# EasyEDA Pro project ProPrj_cap banks_2026-02-15.epro, schematic Schematic3_1
Board Name: RM1822F(pancake)_1; Create Date: 2025-12-31; Page Name: P1; Project Name: cap bank training; Schematic Name: Schematic3_1; Update Date: 2025-12-31; Company: EasyEDA.com; Page Size: A4; Version: V1.0
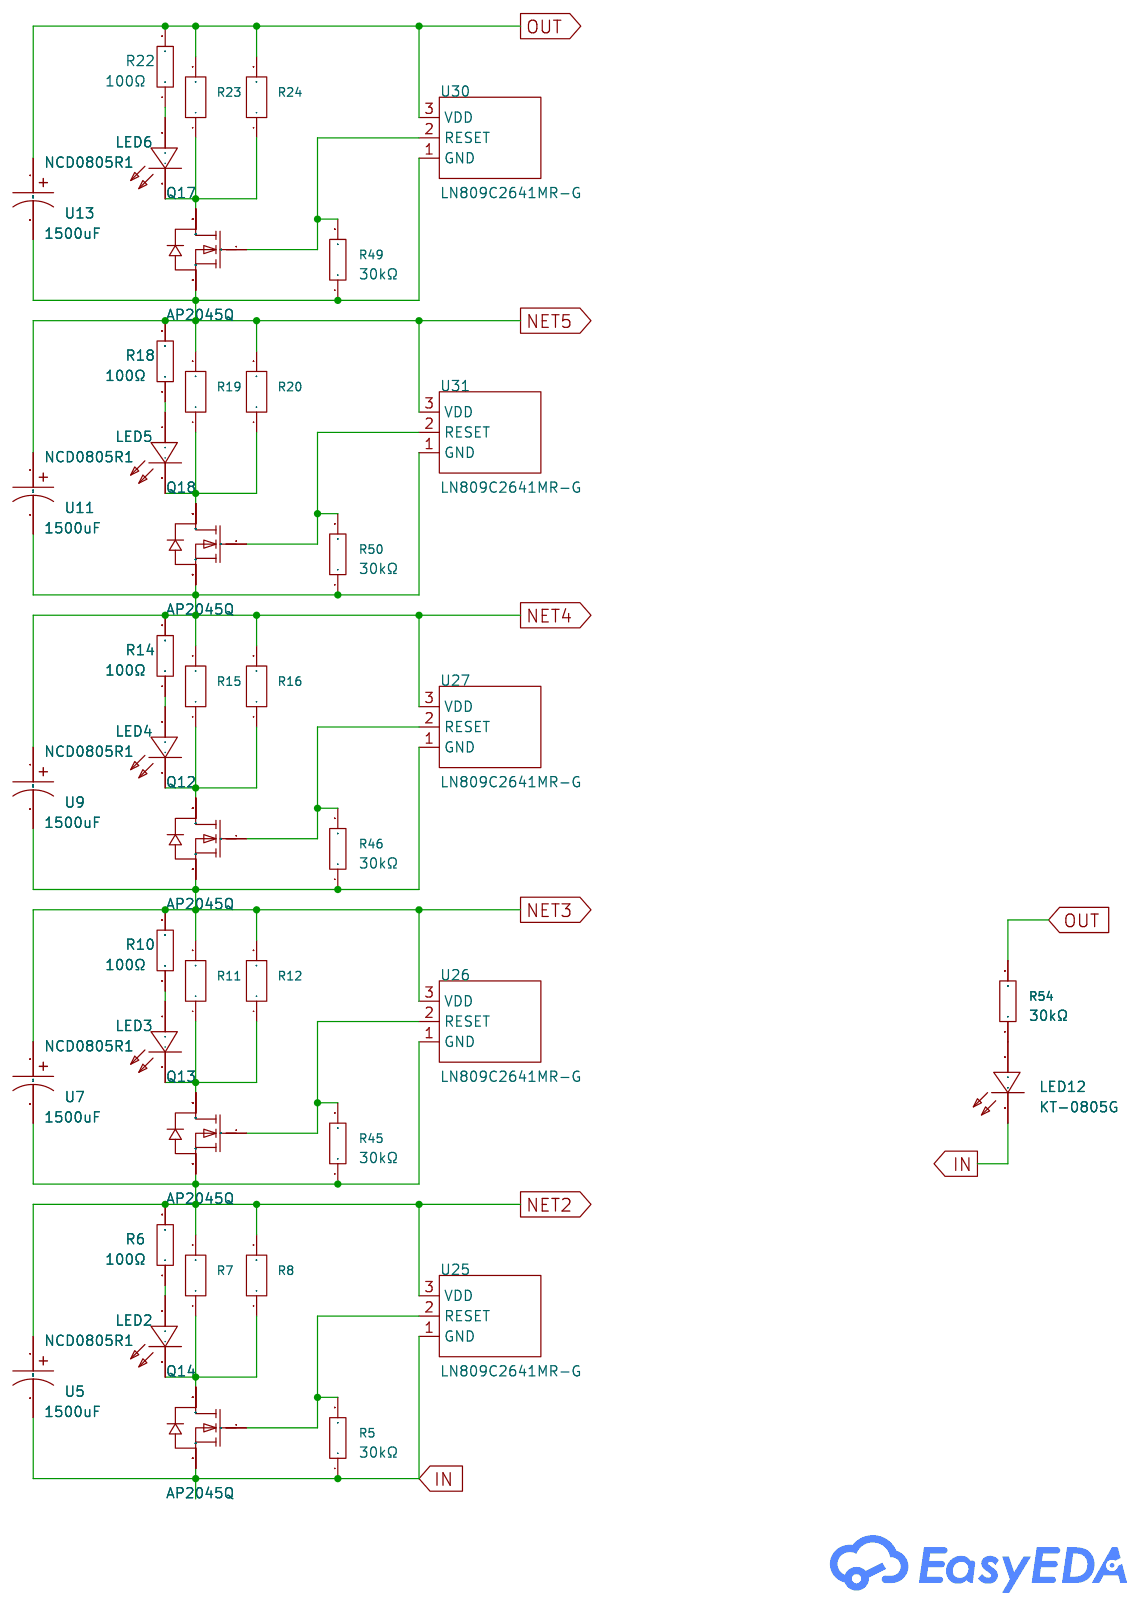
[diagram p3: schematic sheet]

## Parts
LED2  NCD0805R1  [LED0805-R-RD]
LED3  NCD0805R1  [LED0805-R-RD]
LED4  NCD0805R1  [LED0805-R-RD]
LED5  NCD0805R1  [LED0805-R-RD]
LED6  NCD0805R1  [LED0805-R-RD]
LED12  KT-0805G  [LED0805-R-RD]
Q12  AP2045Q  [DFN-8_L3.1-W3.0-P0.65-LS3.3-BL]
Q13  AP2045Q  [DFN-8_L3.1-W3.0-P0.65-LS3.3-BL]
Q14  AP2045Q  [DFN-8_L3.1-W3.0-P0.65-LS3.3-BL]
Q17  AP2045Q  [DFN-8_L3.1-W3.0-P0.65-LS3.3-BL]
Q18  AP2045Q  [DFN-8_L3.1-W3.0-P0.65-LS3.3-BL]
R5  30kΩ  [R0805]
R6  100Ω  [R0805]
R7  1Ω  [R2512]
R8  1Ω  [R2512]
R10  100Ω  [R0805]
R11  1Ω  [R2512]
R12  1Ω  [R2512]
R14  100Ω  [R0805]
R15  1Ω  [R2512]
R16  1Ω  [R2512]
R18  100Ω  [R0805]
R19  1Ω  [R2512]
R20  1Ω  [R2512]
R22  100Ω  [R0805]
R23  1Ω  [R2512]
R24  1Ω  [R2512]
R45  30kΩ  [R0805]
R46  30kΩ  [R0805]
R49  30kΩ  [R0805]
R50  30kΩ  [R0805]
R54  30kΩ  [R0805]
U5  1500uF  [CAP-TH_BD18.0-P7.50-D0.8-FD]
U7  1500uF  [CAP-TH_BD18.0-P7.50-D0.8-FD]
U9  1500uF  [CAP-TH_BD18.0-P7.50-D0.8-FD]
U11  1500uF  [CAP-TH_BD18.0-P7.50-D0.8-FD]
U13  1500uF  [CAP-TH_BD18.0-P7.50-D0.8-FD]
U25  LN809C2641MR-G  [SOT-23-3_L2.9-W1.6-P1.90-LS2.8-BR]
U26  LN809C2641MR-G  [SOT-23-3_L2.9-W1.6-P1.90-LS2.8-BR]
U27  LN809C2641MR-G  [SOT-23-3_L2.9-W1.6-P1.90-LS2.8-BR]
U30  LN809C2641MR-G  [SOT-23-3_L2.9-W1.6-P1.90-LS2.8-BR]
U31  LN809C2641MR-G  [SOT-23-3_L2.9-W1.6-P1.90-LS2.8-BR]

## Library data of the parts
LED2-LED6 = NCD0805R1_C84256: Lamp Holder Type:- Emitted Color:Red Forward Voltage (VF):1.6V~2.6V Forward Voltage (VF):1.6V~2.6V Power Dissipation:65mW Forward Current:20mA Dominant Wavelength:615nm~630nm Dominant Wavelength:615nm~630nm Peak Wavelength:- Diode Configuration:独立二极管 Lens; Supplier Part: C84256; Manufacturer: 国星光电; Supplier Footprint: 0805; JLCPCB Part Class: Basic Part; Datasheet: https://atta.szlcsc.com/upload/public/pdf/source/20200820/C84256_F0A75A43B3EAD75808600A0514C76B99.pdf; Supplier: LCSC; Emitted Color: Red; Forward Voltage (VF): 1.6V~2.6V; Power Dissipation: 65mW; Forward Current: 20mA; Dominant Wavelength: 615nm~630nm; Diode Configuration: 独立二极管; Lens Color: 无色透明透镜; Luminous Intensity: 67mcd~195mcd; Viewing Angle: 130°; Operating Temperature: -30℃~+85℃; Check: true
LED12 = KT-0805G: Lamp Holder Type:- Illumination Color:Emerald Green Voltage - Forward(Vf):2.6V~3.1V Voltage - Forward(Vf):2.6V~3.1V Power(Watts):100mW Forward Current:5mA Wavelength - Dominant:513nm~528nm Wavelength - Dominant:513nm~528nm Peak Wavelength:525nm Diode Conf; LCSC Part Name: 0805 翠绿 高亮; Supplier Part: C2297; Manufacturer: KENTO; Supplier Footprint: 0805; JLCPCB Part Class: Basic Part; Datasheet: https://item.szlcsc.com/datasheet/KT-0805G/2670.html; Supplier: LCSC; Illumination Color: Emerald Green; Voltage - Forward(Vf): 2.6V~3.1V; Power(Watts): 100mW; Forward Current: 5mA; Wavelength - Dominant: 513nm~528nm; Peak Wavelength: 525nm; Luminous Intensity: 430mcd; Viewing Angle: 120°; Operating Temperature: -40℃~+85℃
Q12-Q14 Q17 Q18 = AP2045Q: Number:One N-channel Drain to Source Voltage:20V Current - Continuous Drain(Id):65A RDS(on):5.5mΩ@4.5V Pd - Power Dissipation:35W Gate Threshold Voltage (Vgs(th)):900mV@1mA Gate Charge(Qg):99.2nC Input Capacitance(Ciss):4.4nF Reverse Transfer Capacitance; LCSC Part Name: 1个N沟道 耐压:20V 电流:65A; Supplier Part: C2828594; Manufacturer: ALLPOWER(铨力); Supplier Footprint: DFN-8(3x3.1); JLCPCB Part Class: Extended Part; Datasheet: https://item.szlcsc.com/datasheet/AP2045Q/2976820.html; Supplier: LCSC; Number: One N-channel; Drain to Source Voltage: 20V; Current - Continuous Drain(Id): 65A; RDS(on): 5.5mΩ@4.5V; Pd - Power Dissipation: 35W; Gate Threshold Voltage (Vgs(th)): 900mV@1mA; Gate Charge(Qg): 99.2nC; Input Capacitance(Ciss): 4.4nF; Reverse Transfer Capacitance (Crss@Vds): 400pF; Operating Temperature: -55℃~+150℃; Type: N-Channel
R5 R45 R46 R49 R50 R54 = 0805W8F3002T5E: Type:Thick Film Resistors Resistance:30kΩ Tolerance:±1% Tolerance:±1% Power(Watts): Overload Voltage (Max): Temperature Coefficient:±100ppm/℃ Temperature Coefficient:±100ppm/℃ Operating Temperature Range:-55℃~+155℃ Operating Temperature Range:-55℃~+155℃; LCSC Part Name: 30kΩ ±1% 125mW 厚膜电阻; Supplier Part: C17621; Manufacturer: UNI-ROYAL(厚声); Supplier Footprint: 0805; JLCPCB Part Class: Basic Part; Datasheet: https://atta.szlcsc.com/upload/public/pdf/source/20200306/C422600_1E6D84923E4A46A82E41ADD87F860B5C.pdf; Supplier: LCSC; Type: Thick Film Resistors; Tolerance: ±1%; Temperature Coefficient: ±100ppm/℃; Operating Temperature Range: -55℃~+155℃; Check: true
R6 R10 R14 R18 R22 = 0805W8F1000T5E_C17408: Type:Thick Film Resistors Resistance: Tolerance:±1% Tolerance:±1% Power(Watts): Overload Voltage (Max): Temperature Coefficient:±100ppm/℃ Temperature Coefficient:±100ppm/℃ Operating Temperature Range:-55℃~+155℃ Operating Temperature Range:-55℃~+155℃; LCSC Part Name: 100Ω ±1% 125mW 厚膜电阻; Supplier Part: C17408; Manufacturer: UNI-ROYAL(厚声); Manufacturer Part: 0805W8F1000T5E; Supplier Footprint: 0805; JLCPCB Part Class: Basic Part; Datasheet: https://atta.szlcsc.com/upload/public/pdf/source/20200306/C422600_1E6D84923E4A46A82E41ADD87F860B5C.pdf; Supplier: LCSC; Type: Thick Film Resistors; Tolerance: ±1%; Temperature Coefficient: ±100ppm/℃; Operating Temperature Range: -55℃~+155℃; Check: true
R7 R8 R11 R12 R15 R16 R19 R20 R23 R24 = FRC2512J1R0TS: Type:Thick Film Resistor Resistance:1Ω Tolerance:±5% Tolerance:±5% Power(Watts):1W Voltage-Supply(Max):200V Temperature Coefficient:±200ppm/℃ Temperature Coefficient:±200ppm/℃ Operating Temperature:-55℃~+155℃ Operating Temperature:-55℃~+155℃; LCSC Part Name: 1Ω ±5% 1W 厚膜电阻; Supplier Part: C3000711; Manufacturer: FOJAN(富捷); Supplier Footprint: 2512; JLCPCB Part Class: Extended Part; Supplier: LCSC; Type: Thick Film Resistor; Tolerance: ±5%; Power(Watts): 1W; Voltage-Supply(Max): 200V; Temperature Coefficient: ±200ppm/℃; Operating Temperature: -55℃~+155℃
U5 U7 U9 U11 U13 = 80ZLH1500MEFC18X40: Capacitance: Tolerance:±20% Tolerance:±20% Rated Voltage: Ripple Current:- Equivalent Series Resistance(ESR):- Lead Spacing:7.5mm φD: L: Lifetime @ Temp:- Operating Temperature:-40℃~+105℃ Operating Temperature:-40℃~+105℃; LCSC Part Name: 1500uF ±20% 80V; Supplier Part: C700879; Manufacturer: rubycon(红宝石); Supplier Footprint: 插件,D18xL40mm; JLCPCB Part Class: Extended Part; Datasheet: https://atta.szlcsc.com/upload/public/pdf/source/20200710/C700879_22A88F1D2FB7159B35BD93EA845084AE.pdf; Supplier: LCSC; Tolerance: ±20%; Lead Spacing: 7.5mm; Operating Temperature: -40℃~+105℃; Check: true
U25-U27 U30 U31 = LN809C2641MR-G: ChipType:Voltage Monitor Output Type:Push-pull Voltage - Supply:700mV~6V Voltage - Supply:700mV~6V Threshold Voltage:2.63V Manual Reset:No Watchdog:No Reset Timeout:50ms Operating Temperature:-30℃~+85℃ Operating Temperature:-30℃~+85℃ Quiescent Current:1uA; LCSC Part Name: 内置延时高精度低功耗电压检测; Supplier Part: C3007983; Manufacturer: natlinear(南麟); Supplier Footprint: SOT-23-3L; JLCPCB Part Class: Extended Part; Datasheet: https://item.szlcsc.com/datasheet/LN809C2641MR-G/3498161.html; Supplier: LCSC; ChipType: Voltage Monitor; Output Type: Push-pull; Voltage - Supply: 700mV~6V; Threshold Voltage: 2.63V; Manual Reset: No; Watchdog: No; Reset Timeout: 50ms; Operating Temperature: -30℃~+85℃; Quiescent Current: 1uA; Check: true

## Nets
IN: LED12.2(K) Q14.1(S) Q14.2(S) Q14.3(S) R5.1 U5.2 U25.1(GND)
NET2: Q13.1(S) Q13.2(S) Q13.3(S) R6.2 R7.2 R8.2 R45.1 U5.1 U7.2 U25.3(VDD) U26.1(GND)
NET3: Q12.1(S) Q12.2(S) Q12.3(S) R10.2 R11.2 R12.2 R46.1 U7.1 U9.2 U26.3(VDD) U27.1(GND)
NET4: Q18.1(S) Q18.2(S) Q18.3(S) R14.2 R15.2 R16.2 R50.1 U9.1 U11.2 U27.3(VDD) U31.1(GND)
NET5: Q17.1(S) Q17.2(S) Q17.3(S) R18.2 R19.2 R20.2 R49.1 U11.1 U13.2 U30.1(GND) U31.3(VDD)
OUT: R22.2 R23.2 R24.2 R54.2 U13.1 U30.3(VDD)
$1N1123: LED2.1(+) R6.1
$1N1124: LED2.2(-) Q14.5(D) Q14.6(D) Q14.7(D) Q14.8(D) R7.1 R8.1
$1N1142: LED3.1(+) R10.1
$1N1143: LED3.2(-) Q13.5(D) Q13.6(D) Q13.7(D) Q13.8(D) R11.1 R12.1
$1N1161: LED4.1(+) R14.1
$1N1162: LED4.2(-) Q12.5(D) Q12.6(D) Q12.7(D) Q12.8(D) R15.1 R16.1
$1N1168: Q12.4(G) R46.2 U27.2(RESET)
$1N1174: Q14.4(G) R5.2 U25.2(RESET)
$1N1180: Q13.4(G) R45.2 U26.2(RESET)
$1N1899: LED5.1(+) R18.1
$1N1900: LED5.2(-) Q18.5(D) Q18.6(D) Q18.7(D) Q18.8(D) R19.1 R20.1
$1N1901: Q18.4(G) R50.2 U31.2(RESET)
$1N1917: LED6.1(+) R22.1
$1N1918: LED6.2(-) Q17.5(D) Q17.6(D) Q17.7(D) Q17.8(D) R23.1 R24.1
$1N1919: Q17.4(G) R49.2 U30.2(RESET)
$1N2137: LED12.1(A) R54.1
